# Altium schematic sheet 04 MIMXRT1010 PART1.SchDoc
size 513 x 386 mm
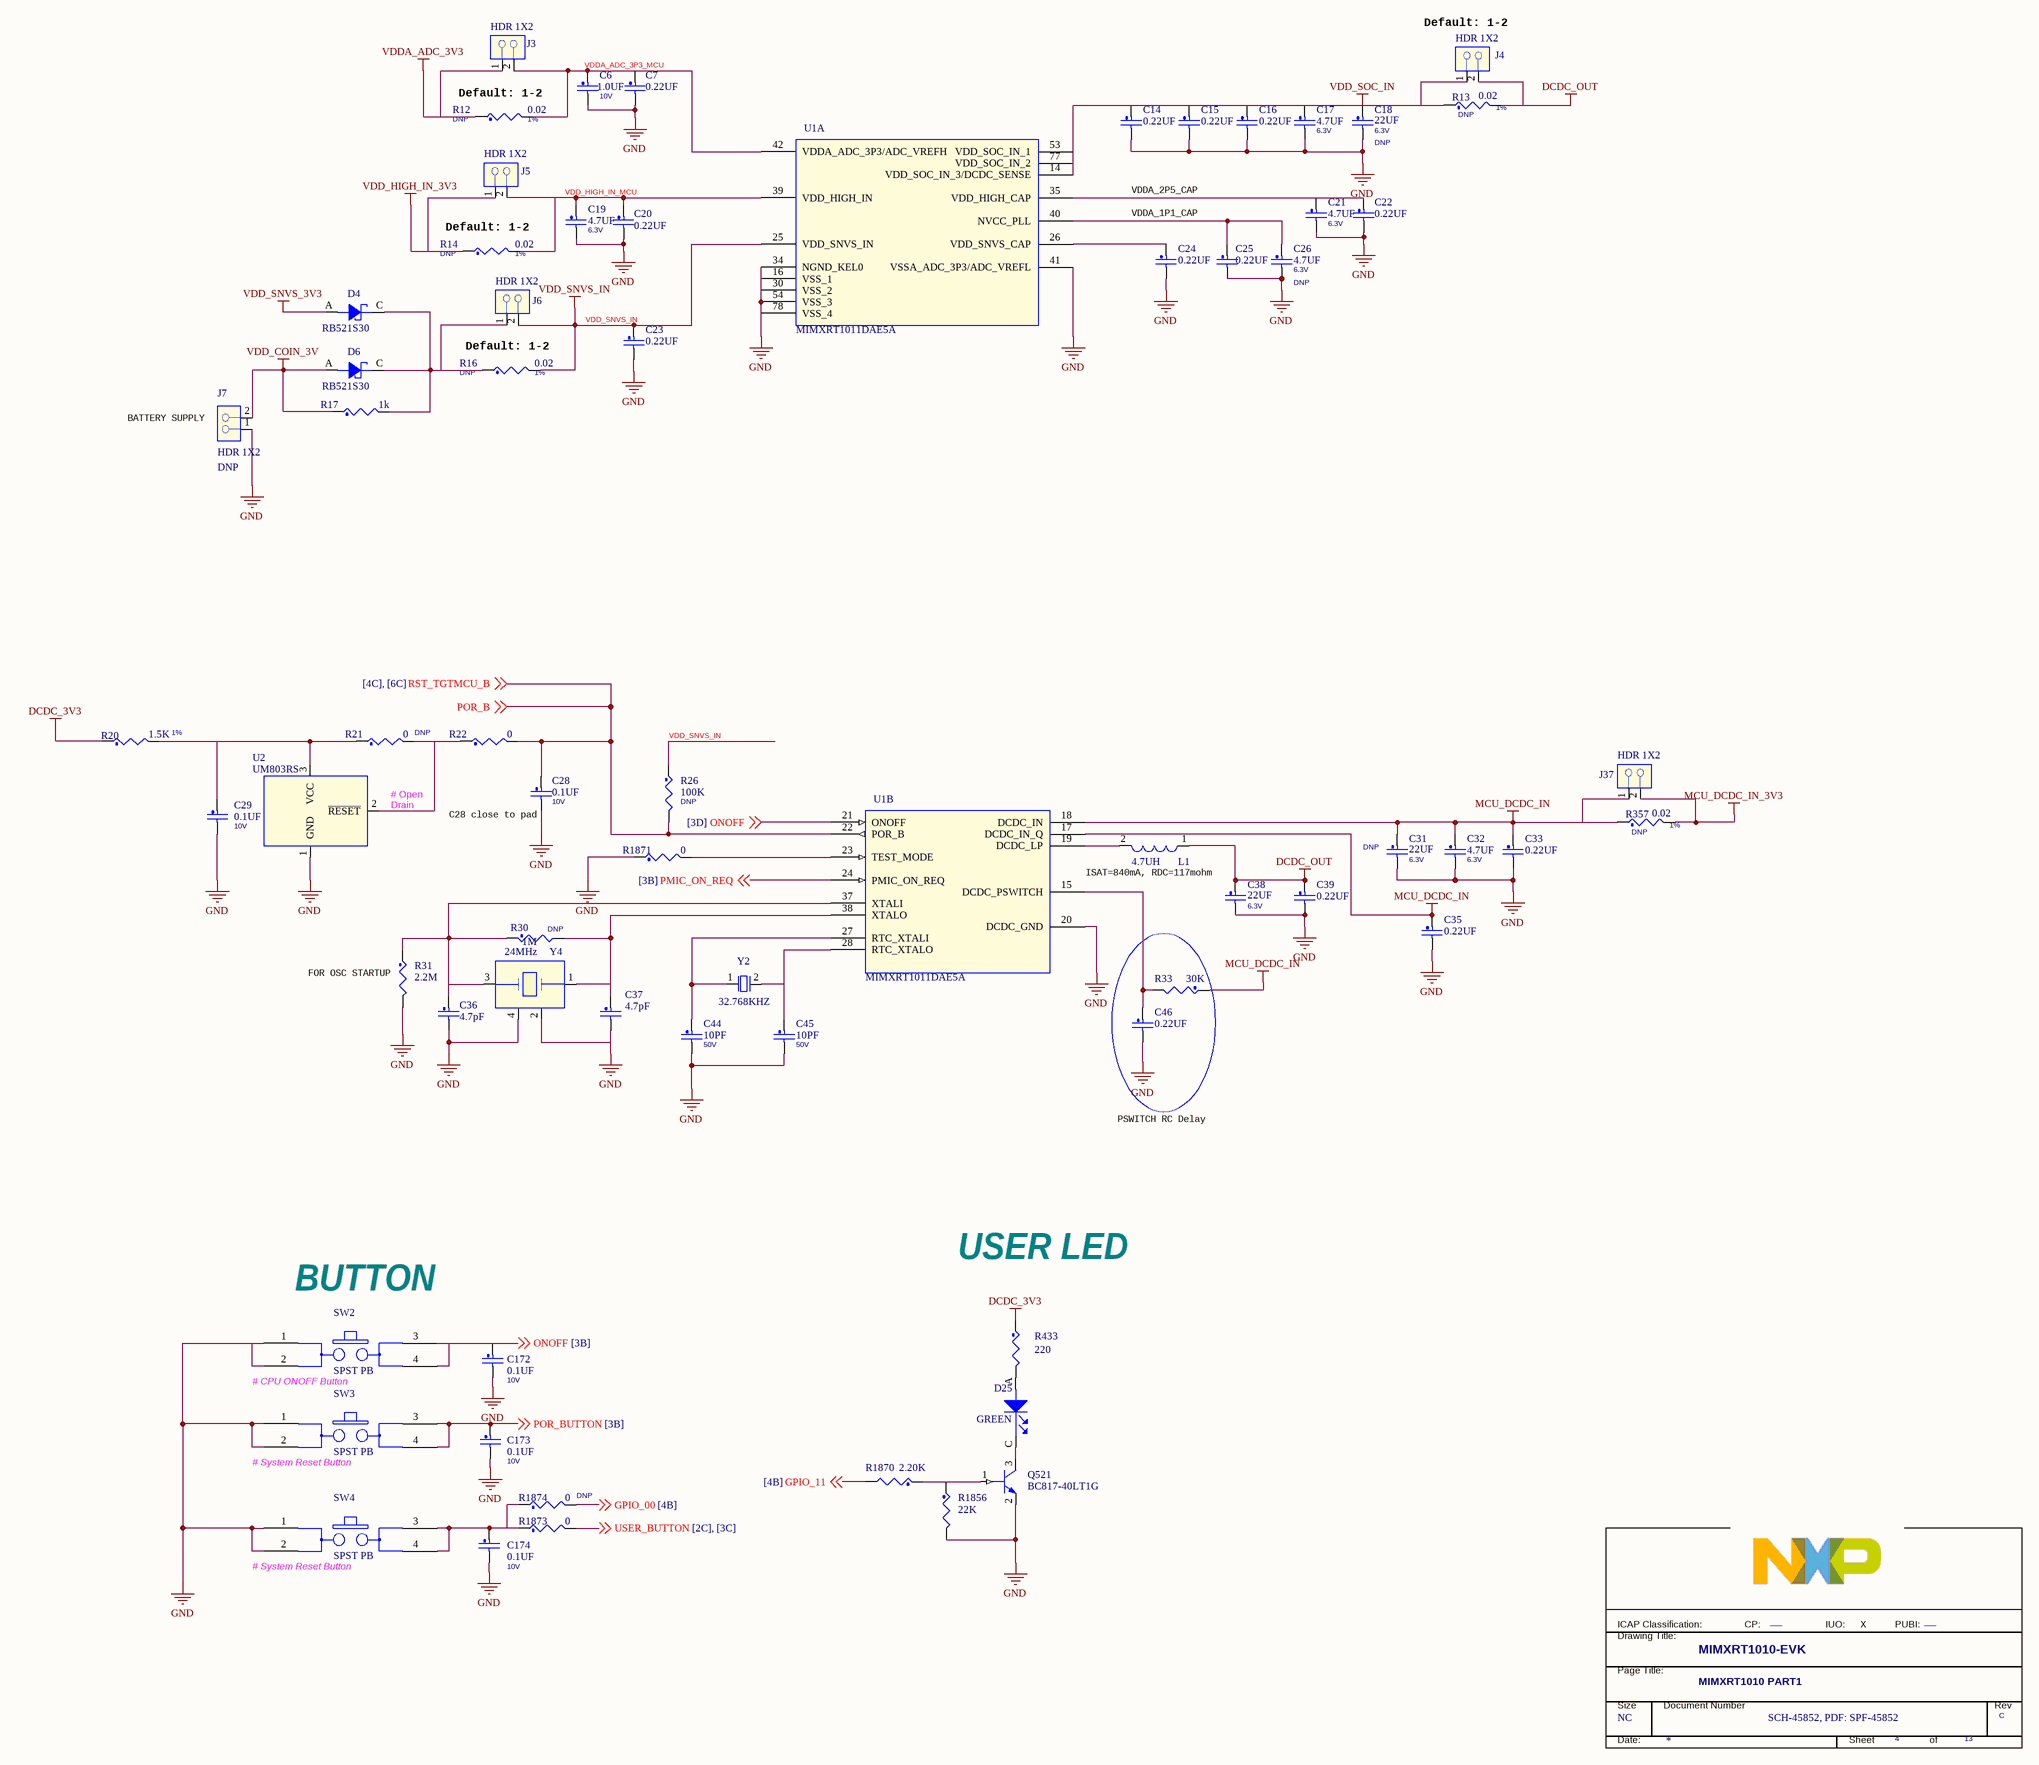
[diagram p0: 04 MIMXRT1010 PART1.SchDoc]

## Parts
*  PUBI: ___  Doc: SCH-45852, PDF: SPF-45852  RevCode: C  Title: MIMXRT1010-EVK  Page Size: NC  Page Number: 4  Page Count: 13  PageTitle: MIMXRT1010 PART1  (hidden comment: TitleBlock_FS)  (graphical)
C6  1.0UF  VOLTAGE: 10V  [0402_cc]
C7  0.22UF  [0402_CC]
C14  0.22UF  [0402_CC]
C15  0.22UF  [0402_CC]
C16  0.22UF  [0402_CC]
C17  4.7UF  VOLTAGE: 6.3V  [0402_CC]
C18  22UF  ASSY_OPT: DNP  voltage rating: 6.3V  [0603_CC]
C19  4.7UF  voltage rating: 6.3V  [0402_CC]
C20  0.22UF  [0402_CC]
C21  4.7UF  voltage rating: 6.3V  [0402_CC]
C22  0.22UF  [0402_CC]
C23  0.22UF  [0402_CC]
C24  0.22UF  [0402_CC]
C25  0.22UF  [0402_CC]
C26  4.7UF  ASSY_OPT: DNP  voltage rating: 6.3V  [0402_CC]
C28  0.1UF  VOLTAGE: 10V  [CC0402_25]
C29  0.1UF  VOLTAGE: 10V  [CC0402_25]
C31  22UF  ASSY_OPT: DNP  voltage rating: 6.3V  [0603_CC]
C32  4.7UF  voltage rating: 6.3V  [0402_CC]
C33  0.22UF  [0402_CC]
C35  0.22UF  [0402_CC]
C36  4.7pF  [0402_CC]
C37  4.7pF  [0402_CC]
C38  22UF  voltage rating: 6.3V  [0603_CC]
C39  0.22UF  [0402_CC]
C44  10PF  VOLTAGE: 50V  [0402_CC]
C45  10PF  VOLTAGE: 50V  [0402_CC]
C46  0.22UF  [0402_CC]
C172  0.1UF  VOLTAGE: 10V  [CC0402_25]
C173  0.1UF  VOLTAGE: 10V  [CC0402_25]
C174  0.1UF  VOLTAGE: 10V  [CC0402_25]
D4  RB521S30  [SOD523]
D6  RB521S30  [SOD523]
D25  GREEN  [LED_0603]
J3  HDR 1X2  [HDR102]
J4  HDR 1X2  [HDR102]
J5  HDR 1X2  [HDR102]
J6  HDR 1X2  [HDR102]
J7  HDR 1X2  ASSY_OPT: DNP  [HDR102]
J37  HDR 1X2  [HDR102]
L1  4.7UH  [ind_1515]
Q521  BC817-40LT1G  [SOT23]
R12  0.02  ASSY_OPT: DNP  TOL: 1%  [RC0603_OV]
R13  0.02  TOL: 1%  ASSY_OPT: DNP  [RC0603_OV]
R14  0.02  ASSY_OPT: DNP  TOL: 1%  [RC0603_OV]
R16  0.02  TOL: 1%  ASSY_OPT: DNP  [RC0603_OV]
R17  1k  [0402_CC]
R20  1.5K  Tolerance: 1%  [0402_CC]
R21  0  ASSY_OPT: DNP  [0402_CC]
R22  0  [0402_CC]
R26  100K  ASSY_OPT: DNP  [0402_CC]
R30  1M  ASSY_OPT: DNP  [0402_CC]
R31  2.2M  [RC0402_25]
R33  30K  [RC0402_25]
R357  0.02  ASSY_OPT: DNP  TOL: 1%  [RC0603_OV]
R433  220  [RC0603_OV]
R1856  22K  [RC0402_25]
R1870  2.20K  [RC0603_OV]
R1871  0  [0402_CC]
R1873  0  [0402_CC]
R1874  0  ASSY_OPT: DNP  [0402_CC]
SW2  SPST PB  [SW4_PB_ESW_SM_P177]
SW3  SPST PB  [SW4_PB_ESW_SM_P177]
SW4  SPST PB  [SW4_PB_ESW_SM_P177]
U1  MIMXRT1011DAE5A  [LQFP80_0P5_12X12]  (parts A,B of 5)
U2  UM803RS  [sot-23]
Y2  32.768KHZ  [XTAL2-3p2x1p5-SM]
Y4  24MHz  [xtl4_2p1x1p7mm_sm]

## Nets
DCDC_3V3: R20.1 R433.1
DCDC_OUT: C38.1 C39.1 J4.2 L1.1 R13.2
GND: C6.2 C7.2 C14.2 C15.2 C16.2 C17.2 C18.2 C19.2 C20.2 C21.2 C22.2 C23.2 C24.2 C25.2 C26.2 C28.2 C29.2 C31.2 C32.2 C33.2 C35.2 C36.2 C37.2 C38.2 C39.2 C44.2 C45.2 C46.2 C172.2 C173.2 C174.2 J7.1 Q521.2(EMITTER) R31.2 R1856.2 R1871.1 SW2.1(A1) SW2.2(A2) SW3.1(A1) SW3.2(A2) SW4.1(A1) SW4.2(A2) U1.16(VSS_1) U1.20(DCDC_GND) U1.30(VSS_2) U1.34(NGND_KEL0) U1.41(VSSA_ADC_3P3/ADC_VREFL) U1.54(VSS_3) U1.78(VSS_4) U2.1(GND) Y4.2 Y4.4
MCU_DCDC_IN: C31.1 C32.1 C33.1 C35.1 J37.1 R33.1 R357.1 U1.17(DCDC_IN_Q) U1.18(DCDC_IN)
MCU_DCDC_IN_3V3: J37.2 R357.2
VDD_COIN_3V: D6.A J7.2 R17.1
VDD_HIGH_IN_3V3: J5.1 R14.1
VDD_SNVS_3V3: D4.A
VDD_SNVS_IN: C23.1 J6.2 R16.2 R26.1 U1.25(VDD_SNVS_IN)
VDD_SOC_IN: C14.1 C15.1 C16.1 C17.1 C18.1 J4.1 R13.1 U1.14(VDD_SOC_IN_3/DCDC_SENSE) U1.53(VDD_SOC_IN_1) U1.77(VDD_SOC_IN_2)
VDDA_ADC_3V3: J3.1 R12.1
GPIO_00: R1874.2 ; off-sheet GPIO_00
GPIO_11: R1870.2 ; off-sheet GPIO_11
ONOFF: C172.1 SW2.3(B1) SW2.4(B2) U1.21(ONOFF) ; off-sheet ONOFF
PMIC_ON_REQ: U1.24(PMIC_ON_REQ) ; off-sheet PMIC_ON_REQ
POR_B: C28.1 R22.2 R26.2 U1.22(POR_B) ; off-sheet RST_TGTMCU_B, off-sheet POR_B  [also labelled RST_TGTMCU_B]
POR_BUTTON: C173.1 SW3.3(B1) SW3.4(B2) ; off-sheet POR_BUTTON
USER_BUTTON: R1873.2 ; off-sheet USER_BUTTON
VDD_HIGH_IN_MCU: C19.1 C20.1 J5.2 R14.2 U1.39(VDD_HIGH_IN)
VDDA_ADC_3P3_MCU: C6.1 C7.1 J3.2 R12.2 U1.42(VDDA_ADC_3P3/ADC_VREFH)
NetC21_1: C21.1 C22.1 U1.35(VDD_HIGH_CAP)
NetC24_1: C24.1 U1.26(VDD_SNVS_CAP)
NetC25_1: C25.1 C26.1 U1.40(NVCC_PLL)
NetC29_1: C29.1 R20.2 R21.1 U2.3(VCC)
NetC36_1: C36.1 R30.1 R31.1 U1.37(XTALI) Y4.3
NetC37_1: C37.1 R30.2 U1.38(XTALO) Y4.1
NetC44_1: C44.1 U1.27(RTC_XTALI) Y2.1
NetC45_1: C45.1 U1.28(RTC_XTALO) Y2.2
NetC46_1: C46.1 R33.2 U1.15(DCDC_PSWITCH)
NetC174_1: C174.1 R1873.1 R1874.1 SW4.3(B1) SW4.4(B2)
NetD4_C: D4.C D6.C J6.1 R16.1 R17.2
NetD25_A: D25.A(ANODE) R433.2
NetD25_C: D25.C(CATHODE) Q521.3(COLLECTOR)
NetL1_2: L1.2 U1.19(DCDC_LP)
NetQ521_1: Q521.1(BASE) R1856.1 R1870.1
NetR21_2: R21.2 R22.1 U2.2(~{RESET})
NetR1871_2: R1871.2 U1.23(TEST_MODE)

## Notes on the sheet
- (near J4) Default: 1-2
- (near R12) Default: 1-2
- VDDA_2P5_CAP
- VDDA_1P1_CAP
- (near R14) Default: 1-2
- Default: 1-2
- BATTERY SUPPLY
- (near U2) # Open
  Drain
- (near C28) C28 close to pad
- ISAT=840mA, RDC=117mohm
- (near R31) FOR OSC STARTUP
- PSWITCH RC Delay
- (near SW2) BUTTON
- USER LED
- (near SW2) # CPU ONOFF Button
- (near SW3) # System Reset Button
- (near SW4) # System Reset Button
- X
- (in symbol TitleBlock_FS) ICAP Classification:; CP:; IUO:; PUBI:; Drawing Title:; Page Title:; Size; Document Number; Rev; Date:; Sheet; of

## Library data of the parts
* = TitleBlock_FS: FIUO: _X_; OrgAddr2: Austin, TX 78735-8598; OrgAddr1: 6501 William Cannon Drive West; OrgName: Freescale Semiconductor; FCP: ___; Page Create Date: March  8, 1995; Page Modify Date: *
C6 = CAP_NP: CAP CER 1.0UF 10V 10% X5R 0402; CLASS: DISCRETE; FPLIST: CC0402_25,CC0402_HD,0402_CC; CAD_APPROVED: Yes; MFG_PN01: CC0402KRX5R6BB105; MFG_NAME01: YAGEO AMERICA; AGILE_PN: 150-75772; PCB Footprint: 0402_cc; HEIGHT: 0.6MM; ROHS: Yes
C7 C20 C22 C24 C25 C35 C46 = CAP_NP: CAP CER 0.22UF 6.3V 20% X5R 0402; CLASS: DISCRETE; AGILE_PN: 150-76271; MFG_NAME01: KEMET; MFG_PN01: C0402C224M9PAC; CAD_APPROVED: Yes; FPLIST: CC0402_25,CC0402_HD,0402_CC; PCB Footprint: 0402_CC; Tolerance: 20%; ROHS: Yes; HEIGHT: 0.55MM; VOLTAGE: 6.3V
C14-C16 C23 C33 C39 = CAP_NP: CAP CER 0.22UF 6.3V 20% X5R 0402; CLASS: DISCRETE; FPLIST: CC0402_25,CC0402_HD,0402_CC; CAD_APPROVED: Yes; MFG_PN01: C0402C224M9PAC; MFG_NAME01: KEMET; AGILE_PN: 150-76271; PCB Footprint: 0402_CC; VOLTAGE: 6.3V; HEIGHT: 0.55MM; ROHS: Yes; Tolerance: 20%
C17 C21 C26 = CAP_NP: CAP CER 4.7UF 6.3V 20% X5R 0402; CLASS: DISCRETE; AGILE_PN: 150-78463; MFG_NAME01: TDK; MFG_PN01: C1005X5R0J475M050BC; CAD_APPROVED: Yes; FPLIST: CC0402_25,CC0402_HD,0402_CC; PCB Footprint: 0402_CC; Tolerance: 20%; ROHS: Yes; HEIGHT: 0.65MM
  C17: voltage rating: 6.3V
  C21 C26: VOLTAGE: 6.3V
C18 = CAP_NP: CAP CER 22UF 6.3V 20% X5R 0603; CLASS: DISCRETE; AGILE_PN: 150-78467; MFG_NAME01: Samsung; MFG_PN01: CL10A226MQ8NRNE; CAD_APPROVED: Yes; FPLIST: CC0603_OV,CC0603,0603_CC; PCB Footprint: 0603_CC; Tolerance: 20%; ROHS: Yes; HEIGHT: 1MM; VOLTAGE: 6.3V
C19 C32 = CAP_NP: CAP CER 4.7UF 6.3V 20% X5R 0402; CLASS: DISCRETE; FPLIST: CC0402_25,CC0402_HD,0402_CC; CAD_APPROVED: Yes; MFG_PN01: C1005X5R0J475M050BC; MFG_NAME01: TDK; AGILE_PN: 150-78463; PCB Footprint: 0402_CC; HEIGHT: 0.65MM; ROHS: Yes; Tolerance: 20%; VOLTAGE: 6.3V
C28 C29 C173 C174 = CAP_NP: CAP CER 0.1UF 10V 10% X5R 0402; CLASS: DISCRETE; AGILE_PN: 150-75634; MFG_NAME01: YAGEO AMERICA; MFG_PN01: CC0402KRX5R6BB104; CAD_APPROVED: Yes; FPLIST: CC0402_25,CC0402_HD,0402_CC; PCB Footprint: CC0402_25; Tolerance: 10%; ROHS: Yes; HEIGHT: 0.64MM
C31 C38 = CAP_NP: CAP CER 22UF 6.3V 20% X5R 0603; CLASS: DISCRETE; FPLIST: CC0603_OV,CC0603,0603_CC; CAD_APPROVED: Yes; MFG_PN01: CL10A226MQ8NRNE; MFG_NAME01: Samsung; AGILE_PN: 150-78467; PCB Footprint: 0603_CC; VOLTAGE: 6.3V; HEIGHT: 1MM; ROHS: Yes; Tolerance: 20%
C36 = CAP_NP: CAP CER 4.7PF 50V 0.25PF C0G 0402; CLASS: DISCRETE; FPLIST: CC0402_25,CC0402_HD,0402_CC; CAD_APPROVED: Yes; MFG_PN01: 04025A4R7CAT2A; MFG_NAME01: AVX; AGILE_PN: 150-76335; PCB Footprint: 0402_CC; VOLTAGE: 50V; HEIGHT: 0.56MM; ROHS: Yes; Tolerance: 0.25pF
C37 = CAP_NP: CAP CER 4.7PF 50V 0.25PF C0G 0402; CLASS: DISCRETE; AGILE_PN: 150-76335; MFG_NAME01: AVX; MFG_PN01: 04025A4R7CAT2A; CAD_APPROVED: Yes; FPLIST: CC0402_25,CC0402_HD,0402_CC; PCB Footprint: 0402_CC; Tolerance: 0.25pF; ROHS: Yes; HEIGHT: 0.56MM; VOLTAGE: 50V
C44 C45 = CAP_NP: CAP CER 10PF 50V 5% C0G 0402; CLASS: DISCRETE; AGILE_PN: 150-75265; MFG_NAME01: AVX; MFG_PN01: 04025A100JAT2A; CAD_APPROVED: YES; FPLIST: CC0402_25,CC0402_HD,0402_CC; PCB Footprint: 0402_CC; Tolerance: 5%; ROHS: Yes; HEIGHT: 0.635MM
C172 = CAP_NP: CAP CER 0.1UF 10V 10% X5R 0402; CLASS: DISCRETE; FPLIST: CC0402_25,CC0402_HD,0402_CC; CAD_APPROVED: Yes; MFG_PN01: CC0402KRX5R6BB104; MFG_NAME01: YAGEO AMERICA; AGILE_PN: 150-75634; PCB Footprint: CC0402_25; HEIGHT: 0.64MM; ROHS: Yes; Tolerance: 10%
D4 = DIODE_SCHTKY: DIODE SCH RECT 200MA 30V AEC-Q101 SOD-523; CLASS: IC; AGILE_PN: 480-79672; MFG_NAME01: NEXPERIA; MFG_PN01: RB521S30,115; CAD_APPROVED: Yes; ROHS: Yes; HEIGHT: 0.65MM; PCB Footprint: SOD523
D6 = DIODE_SCHTKY: DIODE SCH RECT 200MA 30V AEC-Q101 SOD-523; CLASS: IC; CAD_APPROVED: Yes; MFG_PN01: RB521S30,115; MFG_NAME01: NEXPERIA; AGILE_PN: 480-79672; HEIGHT: 0.65MM; ROHS: Yes; PCB Footprint: SOD523
D25 = LED: LED GRN SGL 25MA 0603; CLASS: IC; AGILE_PN: 370-76549; MFG_NAME01: KINGBRIGHT; MFG_PN01: KPT-1608SGC; CAD_APPROVED: Yes; PCB Footprint: LED_0603; ROHS: Yes; HEIGHT: 0.85MM
J3 J4 = CONN_HDR_2X1: HDR 1X2 TH 100MIL SP 339H AU 98L; CLASS: IO; AGILE_PN: 210-81490; MFG_NAME01: ANYTRONIC CORPORATION LIMITED; MFG_PN01: 0901S0202011N9T-31RF; Temp_Range: -55¡ãC to +105¡ãC; CAD_APPROVED: Yes; ROHS: Yes; HEIGHT: 8.59MM; PCB Footprint: HDR102
J5-J7 J37 = CONN_HDR_2X1: HDR 1X2 TH 100MIL SP 339H AU 98L; CLASS: IO; CAD_APPROVED: Yes; Temp_Range: -55¡ãC to +105¡ãC; MFG_PN01: 0901S0202011N9T-31RF; MFG_NAME01: ANYTRONIC CORPORATION LIMITED; AGILE_PN: 210-81490; HEIGHT: 8.59MM; ROHS: Yes; PCB Footprint: HDR102
L1 = INDUCTOR: IND FER BEAD 4.7uH@100KHZ 0.84A 20% 1515; PART_TYPE: INDUCTOR\1515; CLASS: DISCRETE; CAD_APPROVED: Yes; Temp_Range: -40C - 125C; MFG_PN01: LQH44PN4R7MJ0L; MFG_NAME01: MURATA; AGILE_PN: 180-78961; HEIGHT: 1.2MM; ROHS: Yes; Tolerance: 20%; PCB Footprint: ind_1515
Q521 = NPN: TRAN NPN GEN 45V 0.5A SOT-23; CLASS: IC; CAD_APPROVED: Yes; MFG_NAME01: ON SEMICONDUCTOR; AGILE_PN: 480-75158; PCB Footprint: SOT23; HEIGHT: 1.11 MM; ROHS: Yes; MFG_PN01: BC817-40LT1G
R12 R14 R357 = RES: RES MF 0.02 OHM 1/10W 1% 0603; CLASS: DISCRETE; FPLIST: RC0603_OV,RC0603,0603_CC; CAD_APPROVED: Yes; MFG_PN01: WSL0603R0200FEA; MFG_NAME01: VISHAY INTERTECHNOLOGY; AGILE_PN: 470-80199; Tolerance: 1%; HEIGHT: 0.457MM; ROHS: Yes; PCB Footprint: RC0603_OV
R13 R16 = RES: RES MF 0.02 OHM 1/10W 1% 0603; CLASS: DISCRETE; AGILE_PN: 470-80199; MFG_NAME01: VISHAY INTERTECHNOLOGY; MFG_PN01: WSL0603R0200FEA; CAD_APPROVED: Yes; FPLIST: RC0603_OV,RC0603,0603_CC; ROHS: Yes; HEIGHT: 0.457MM; Tolerance: 1%; PCB Footprint: RC0603_OV
R17 = RES_Dup1: RES MF 1.0K 1/16W 5% 0402; CLASS: DISCRETE; AGILE_PN: 470-75555; MFG_NAME01: VISHAY INTERTECHNOLOGY; MFG_PN01: CRCW04021K00JNED; CAD_APPROVED: Yes; FPLIST: RC0402_25,RC0402_HD,RC0402_X2,0402_CC; Tolerance: 5%; ROHS: Yes; HEIGHT: 0.41mm; PCB Footprint: 0402_CC
R20 = RES_Dup1: RES MF 1.5K 1/16W 1% 0402; CLASS: DISCRETE; FPLIST: RC0402_25,RC0402_HD,0402_CC; CAD_APPROVED: Yes; MFG_PN01: CR0402-FX-1501GLF; MFG_NAME01: BOURNS; AGILE_PN: 470-80487; HEIGHT: 0.4MM; ROHS: Yes; PCB Footprint: 0402_CC
R21 R22 R1874 = RES_Dup1: RES MF ZERO OHM 1/16W 5% 0402; CLASS: DISCRETE; AGILE_PN: 470-75394; MFG_NAME01: ROHM; MFG_PN01: MCR01MZPJ000; CAD_APPROVED: Yes; FPLIST: RC0402_25,RC0402_HD,RC0402_X2,0402_CC; HEIGHT: 0.45 MM; Tolerance: 5%; ROHS: Yes; PCB Footprint: 0402_CC
R26 = RES_Dup1: RES MF 100K 1/16W 5% 0402; CLASS: DISCRETE; Temp_Range: -55C to +155C; FPLIST: RC0402_25,RC0402_HD,0402_CC; CAD_APPROVED: Yes; MFG_PN01: CR0402-16W-104JT; MFG_NAME01: VENKEL COMPANY; AGILE_PN: 470-75597; ROHS: Yes; Tolerance: 5%; HEIGHT: 0.40 MM; PCB Footprint: 0402_CC
R30 = RES_Dup1: RES MF 1M 1/10W 5% AEC-Q200 0402; CLASS: DISCRETE; AGILE_PN: 470-79978; MFG_NAME01: KOA SPEER; MFG_PN01: RK73B1ETTP105J; CAD_APPROVED: Yes; FPLIST: RC0402_25,RC0402_HD,0402_CC; Temp_Range: -55&#8451; to 155&#8451;; PCB Footprint: 0402_CC; HEIGHT: 0.4MM; Tolerance: 5%; ROHS: Yes
R31 = RES_Dup1: RES MF 2.2M 1/10W 1% AEC-Q200 0402; CLASS: DISCRETE; AGILE_PN: 470-31210; MFG_NAME01: KOA SPEER; MFG_PN01: RK73H1ETTP2204F; Temp_Range: -55C to +155C; CAD_APPROVED: Yes; FPLIST: RC0402_25,RC0402_HD,0402_CC; Tolerance: 1%; ROHS: Yes; HEIGHT: 0.40 MM; PCB Footprint: RC0402_25
R33 = RES_Dup1: RES MF 30K 1/16W 1% 0402; CLASS: DISCRETE; AGILE_PN: 470-76590; MFG_NAME01: THYE MING TECH CO LTD; MFG_PN01: CR02FL6-30K; CAD_APPROVED: Yes; FPLIST: RC0402_25,RC0402_HD,0402_CC; Tolerance: 1%; ROHS: Yes; HEIGHT: 0.4MM; PCB Footprint: RC0402_25
R433 = RES_Dup1: RES MF 220 OHM 1/10W 5% 0603; CLASS: DISCRETE; FPLIST: RC0603_OV,RC0603,0603_CC; CAD_APPROVED: Yes; MFG_PN01: RC0603JR-07220RL; MFG_NAME01: YAGEO AMERICA; AGILE_PN: 470-30297; PCB Footprint: RC0603_OV; HEIGHT: 0.6MM; ROHS: Yes; Tolerance: 5%
R1856 = RES_Dup1: RES MF 22K 1/16W 5% 0402; CLASS: DISCRETE; AGILE_PN: 470-75609; MFG_NAME01: SMEC; MFG_PN01: RC73L2Z223JTF; CAD_APPROVED: Yes; FPLIST: RC0402_25,RC0402_HD,0402_CC; PCB Footprint: RC0402_25; Tolerance: 5%; ROHS: Yes; HEIGHT: 0.41mm
R1870 = RES_Dup1: RES MF 2.20K 1/10W 1% 0603; CLASS: DISCRETE; AGILE_PN: 470-75806; MFG_NAME01: BOURNS; MFG_PN01: CR0603-FX-2201ELF; CAD_APPROVED: Yes; FPLIST: RC0603_OV,RC0603,0603_CC; PCB Footprint: RC0603_OV; Tolerance: 1%; ROHS: Yes; HEIGHT: 0.55 MM
R1871 R1873 = RES_Dup1: RES MF ZERO OHM 1/16W 5% 0402; CLASS: DISCRETE; FPLIST: RC0402_25,RC0402_HD,RC0402_X2,0402_CC; CAD_APPROVED: Yes; MFG_PN01: MCR01MZPJ000; MFG_NAME01: ROHM; AGILE_PN: 470-75394; PCB Footprint: 0402_CC; ROHS: Yes; Tolerance: 5%; HEIGHT: 0.45 MM
SW2 SW4 = SW_PB_ESW: SW SPST MOM NO PB TACT 50mA 50V SMT; CLASS: IC; CAD_APPROVED: Yes; MFG_PN01: TL3301AF260QG/TR; MFG_NAME01: E SWITCH; AGILE_PN: 510-77562; PCB Footprint: SW4_PB_ESW_SM_P177; HEIGHT: 5MM; ROHS: Yes
SW3 = SW_PB_ESW: SW SPST MOM NO PB TACT 50mA 50V SMT; CLASS: IC; AGILE_PN: 510-77562; MFG_NAME01: E SWITCH; MFG_PN01: TL3301AF260QG/TR; CAD_APPROVED: Yes; ROHS: Yes; HEIGHT: 5MM; PCB Footprint: SW4_PB_ESW_SM_P177
U1 = RT1010_LQFP80: IC CPU ARM Cortex-M7 500MHZ 1.3V LQFP80; AGILE_PN: 344-02363; MFG_NAME01: NXP SEMICONDUCTORS; MFG_PN01: MIMXRT1011DAE5A; ROHS: Yes; HEIGHT: 1.6MM; PCB Footprint: LQFP80_0P5_12X12
U2 = SGM803_SOT23-3P: IC VOLT MONITOR 2.63V RST VTH 1-5.5V AUTO SOT-23; AGILE_PN: 315-80553; MFG_NAME01: Union Semiconductor, Inc; CAD_APPROVED: Yes; CLASS: IC; MFG_PN01: UM803RS; ROHS: Yes; HEIGHT: 1.25MM; PCB Footprint: sot-23
Y2 = CRYSTAL: XTAL 32.768KHZ 7PF 20PPM -- SMT; CLASS: IC; AGILE_PN: 230-78102; MFG_NAME01: EPSON ELECTRONICS; MFG_PN01: FC-135 32.7680KA-AG3; CAD_APPROVED: Yes; PCB Footprint: XTAL2-3p2x1p5-SM; ROHS: Yes; HEIGHT: 0.9MM
Y4 = XTAL_13: XTAL 24MHZ -- 20PPM 2.0X1.6MM SMD; CLASS: IC; CAD_APPROVED: Yes; Temp_Range: -30C to 85C; MFG_PN01: XRCGB24M000F2P29R0; MFG_NAME01: MURATA; AGILE_PN: 230-78216; PCB Footprint: xtl4_2p1x1p7mm_sm; HEIGHT: 0.7MM; ROHS: Yes